# Altium project CW308T_EMF32TG11.PrjPcb
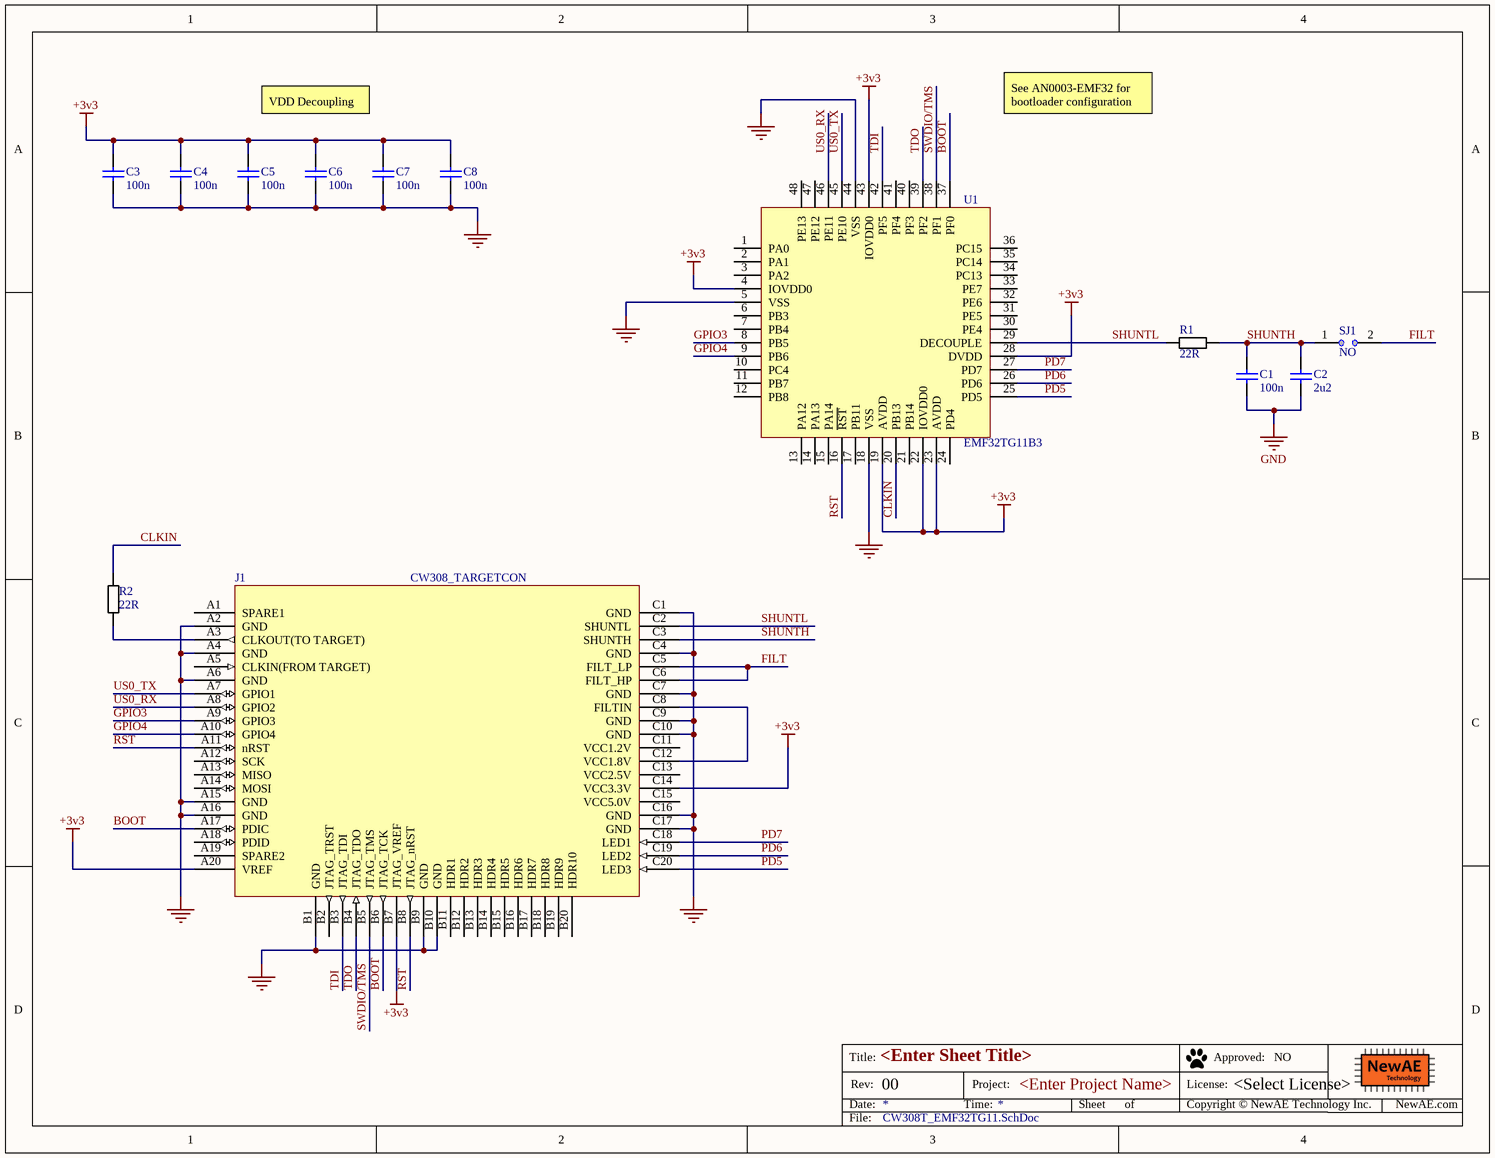
[diagram p0: CW308T_EMF32TG11.SchDoc]
PrjLicense: <Select License>; PrjName: <Enter Project Name>; PrjRev: 00
1 sheet, 13 parts. Net scope: global (net labels, ports and power ports of the same name join across sheets).
Board file: CW308T_EMF32TG11.PcbDoc

## Sheet CW308T_EMF32TG11.SchDoc: <Enter Sheet Title>
size Letter; Organization: NewAE Technology Inc.; Address1: 1083 Queen St., Suite 196; Address2: Halifax; Address3: NS; Address4: Canada B3H 0B2; SheetApproved: NO

### Parts
C1  100n  [CAPC0603_M]
C2  2u2  [CAPC0603_M]
C3  100n  [CAPC0603_M]
C4  100n  [CAPC0603_M]
C5  100n  [CAPC0603_M]
C6  100n  [CAPC0603_M]
C7  100n  [CAPC0603_M]
C8  100n  [CAPC0603_M]
J1  CW308_TARGETCON  [CW308_TBOARD_CONN]
R1  22R  [RESC1608X55N]
R2  22R  [RESC1608X55N]
SJ1  NO  [SJ_2S_NO]  (no BOM)
U1  EMF32TG11B3  [TQFP48-P900X900X120]

### Nets
+3v3: C3.1 C4.1 C5.1 C6.1 C7.1 C8.1 J1.A20(VREF) J1.B7(JTAG_VREF) J1.C14(VCC3.3V) U1.4(IOVDD0) U1.19(AVDD) U1.22(IOVDD0) U1.23(AVDD) U1.28(DVDD) U1.43(IOVDD0)
GND: C1.2 C2.2 C3.2 C4.2 C5.2 C6.2 C7.2 C8.2 J1.A2(GND) J1.A4(GND) J1.A6(GND) J1.A15(GND) J1.A16(GND) J1.B1(GND) J1.B9(GND) J1.B10(GND) J1.C1(GND) J1.C4(GND) J1.C7(GND) J1.C9(GND) J1.C10(GND) J1.C16(GND) J1.C17(GND) U1.5(VSS) U1.18(VSS) U1.44(VSS)
BOOT: J1.A17(PDIC) J1.B6(JTAG_TCK) U1.37(PF0)
CLKIN: R2.1 U1.20(PB13)
FILT: J1.C5(FILT_LP) J1.C6(FILT_HP) SJ1.2
GPIO3: J1.A9(GPIO3) U1.8(PB5)
GPIO4: J1.A10(GPIO4) U1.9(PB6)
PD5: J1.C20(LED3) U1.25(PD5)
PD6: J1.C19(LED2) U1.26(PD6)
PD7: J1.C18(LED1) U1.27(PD7)
RST: J1.A11(nRST) J1.B8(JTAG_nRST) U1.16(~{RST})
SHUNTH: C1.1 C2.1 J1.C3(SHUNTH) R1.2 SJ1.1
SHUNTL: J1.C2(SHUNTL) R1.1 U1.29(DECOUPLE)
SWDIO/TMS: J1.B5(JTAG_TMS) U1.38(PF1)
TDI: J1.B3(JTAG_TDI) U1.42(PF5)
TDO: J1.B4(JTAG_TDO) U1.39(PF2)
US0_RX: J1.A8(GPIO2) U1.46(PE11)
US0_TX: J1.A7(GPIO1) U1.45(PE10)
NetJ1_A3: J1.A3(CLKOUT(TO_TARGET)) R2.2
NetJ1_C8: J1.C8(FILTIN) J1.C12(VCC1.8V)

Not connected (* = marked no-connect by the designer): J1 A1(SPARE1) A5(CLKIN(FROM_TARGET)) A12(SCK) A13(MISO) A14(MOSI) A18(PDID) A19(SPARE2) B2(JTAG_TRST) B11(HDR1) B12(HDR2) B13(HDR3) B14(HDR4) B15(HDR5) B16(HDR6) B17(HDR7) B18(HDR8) B19(HDR9) B20(HDR10) C11(VCC1.2V) C13(VCC2.5V) C15(VCC5.0V); U1 1(PA0) 2(PA1) 3(PA2) 6(PB3) 7(PB4) 10(PC4) 11(PB7) 12(PB8) 13(PA12) 14(PA13) 15(PA14) 17(PB11) 21(PB14) 24(PD4) 30(PE4) 31(PE5) 32(PE6) 33(PE7) 34(PC13) 35(PC14) 36(PC15) 40(PF3) 41(PF4) 47(PE12) 48(PE13)

### Notes on the sheet
- VDD Decoupling
- See AN0003-EMF32 for bootloader configuration
- Title:
- Date:
- Rev:
- Time:
- Project:
- Sheet
- of
- License:
- Copyright © NewAE Technology Inc.
- Approved:
- NewAE.com
- File:

### Library data of the parts
C1 C3-C8 = CCHIP-100n-0603: 100n, 0603; Manufacture 1: Kemet; Manufacture Part Number 1: C0603C104K5RACTU; Component Group: Capacitor; Case-EIA: 0603; Case-Metric: 1608; Rated Voltage: 50VDC; Part Number: CCHIP-100n-0603; Footprint: 0603; Pin Count: 2; Supplier 1: Digi-Key; Supplier Part Number 1: 399-5089-2-ND; Value: 100n; Mounting Technology: SMT; Component Kind: Standard; Component Type: Standard
C2 = CCHIP-2u2-0603: 2u2, 0603; Manufacture 1: Samsung; Manufacture Part Number 1: CL10B225KP8NNNC; Component Group: Capacitor; Case-EIA: 0603; Case-Metric: 1608; Rated Voltage: 10VDC; Part Number: CCHIP-2u2-0603; Footprint: 0603; Pin Count: 2; Supplier 1: Digi-Key; Supplier Part Number 1: 1276-1134-2-ND; Value: 2u2; Mounting Technology: SMT; Component Kind: Standard; Component Type: Standard
J1 = CW308_TBOARD: CW308 "Standard" Target Board Connector; Component Group: Mechanical; Pitch: 2.54mm; Part Number: CW308_TBOARD; Pin Count: 60; Mounting Technology: Through-hole; Component Kind: Standard; Component Type: Standard
R1 R2 = RCHIP-22R-0603: 22R res, 0603, 1%, 1/10W; Manufacture 1: Yageo; Manufacture Part Number 1: RC0603FR-0722RL; Component Group: Resistor; Case-EIA: 0603; Case-Metric: 1608; Rated Power: 0.1W; Rated Voltage: 75VDC; Part Number: RCHIP-22R-0603; Footprint: 0603; Pin Count: 2; Supplier 1: Digi-Key; Supplier Part Number 1: 311-22.0HRCT-ND; Value: 22R; Tolerance: 1%; Mounting Technology: SMT; Temperature Range: -55C to 155C; Component Kind: Standard; Component Type: Standard
SJ1 = SJ_2S_NO: Solder Jumper, NO; Component Group: PCB Feature; Part Number: SJ_2S_NO; Pin Count: 2; Mounting Technology: COPPER; Component Type: Standard (No BOM)
U1 = EMF32TG11B3: MCU EMF32 Tiny Gecko 11 64kB 32kB 37 GPIO; Manufacture 1: Silicon Labs; Manufacture Part Number 1: EFM32TG11B340F64IQ48-A; Component Group: Digital IC; PP Material Stack: 0; Part Number: EMF32TG11B3; Footprint: TQFP48; Pin Count: 48; Supplier 1: Mouser; Supplier Part Number 1: 634-11B340F64IQ48A; Mounting Technology: SMT; RoHS: Yes; Component Kind: Standard; Component Type: Standard; PP Rotation: 0